# Altium project BY-IOM-v0.2.PrjPCB
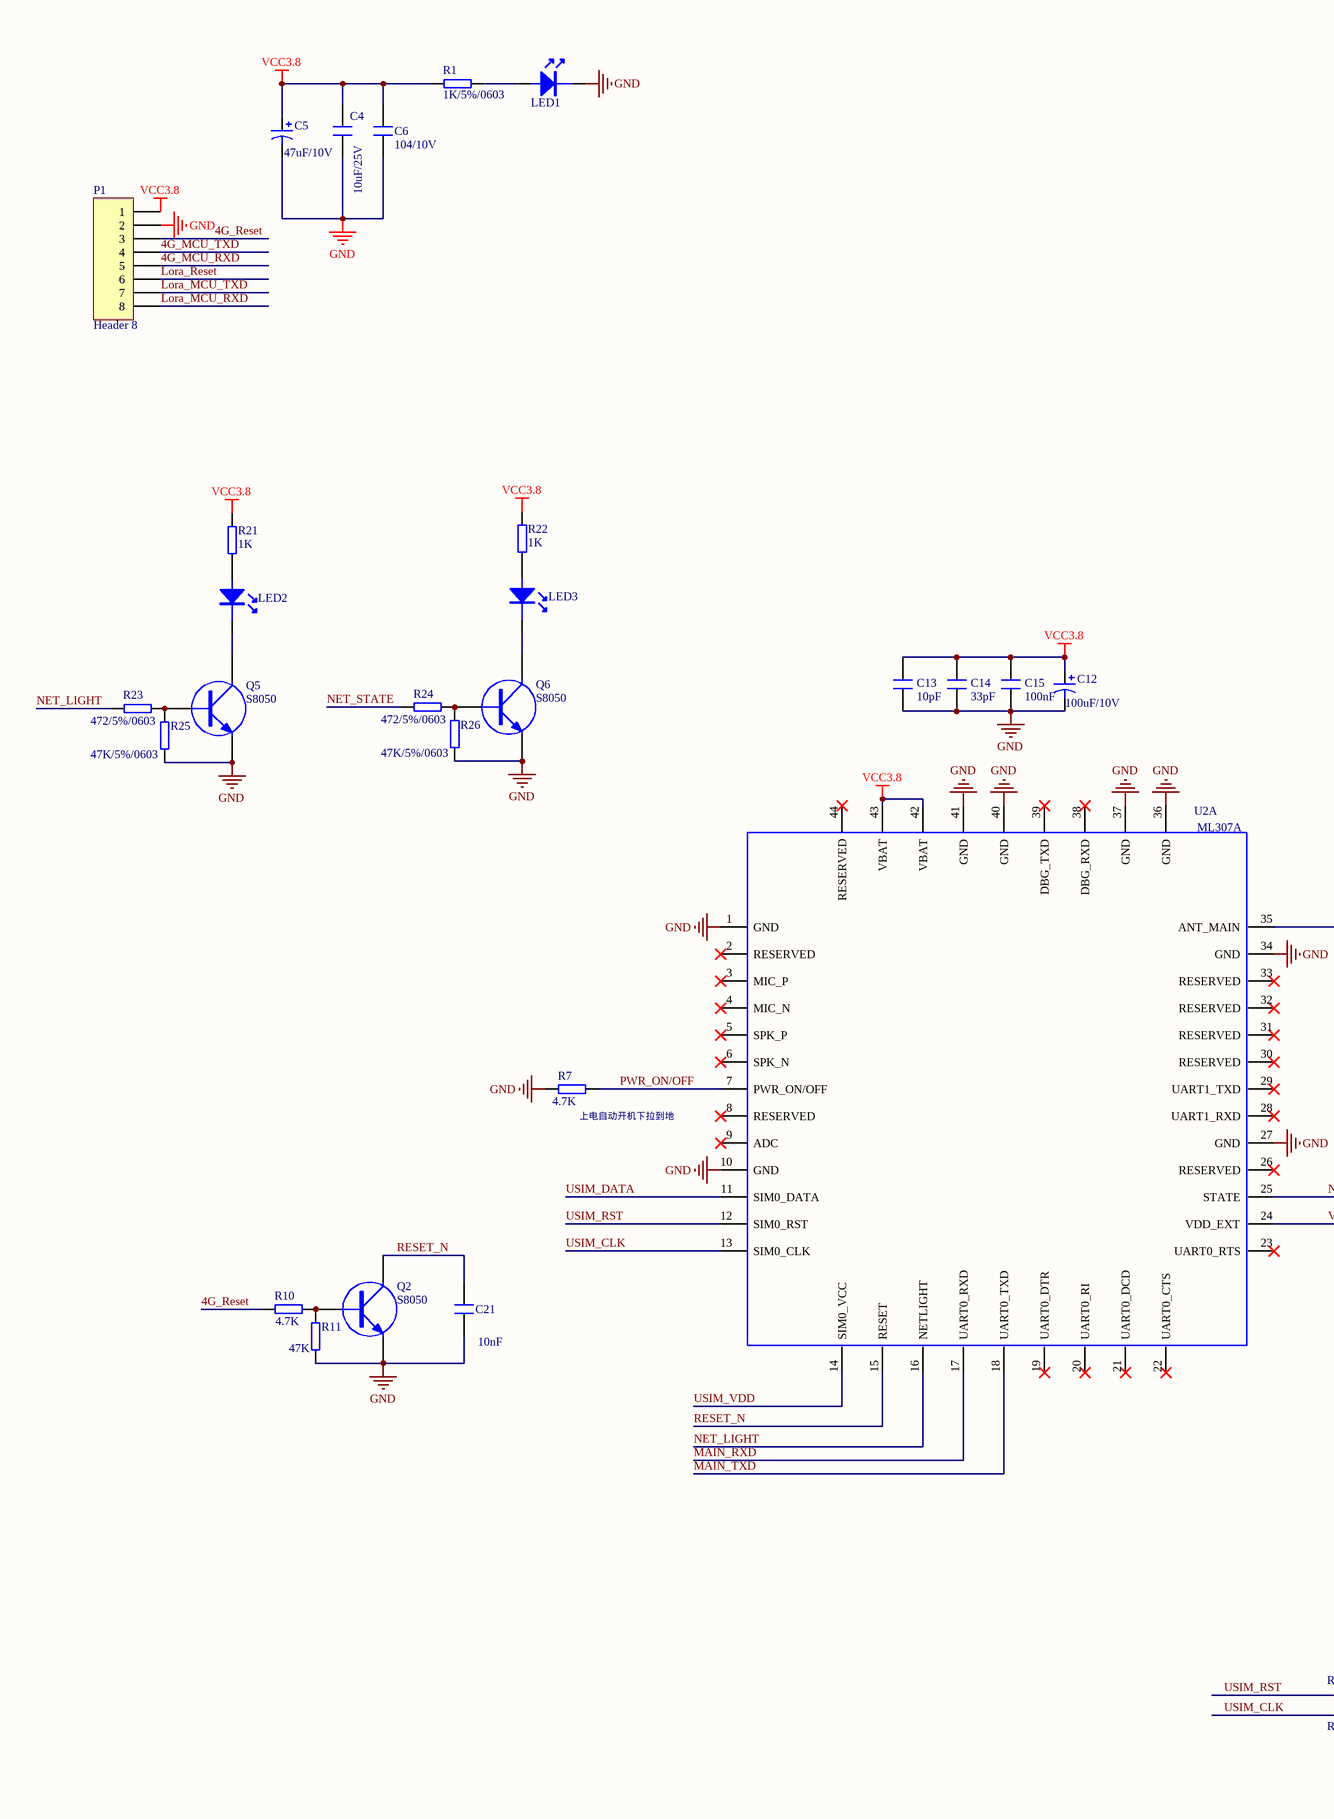
[diagram p0: 4G_Module.SchDoc, left]
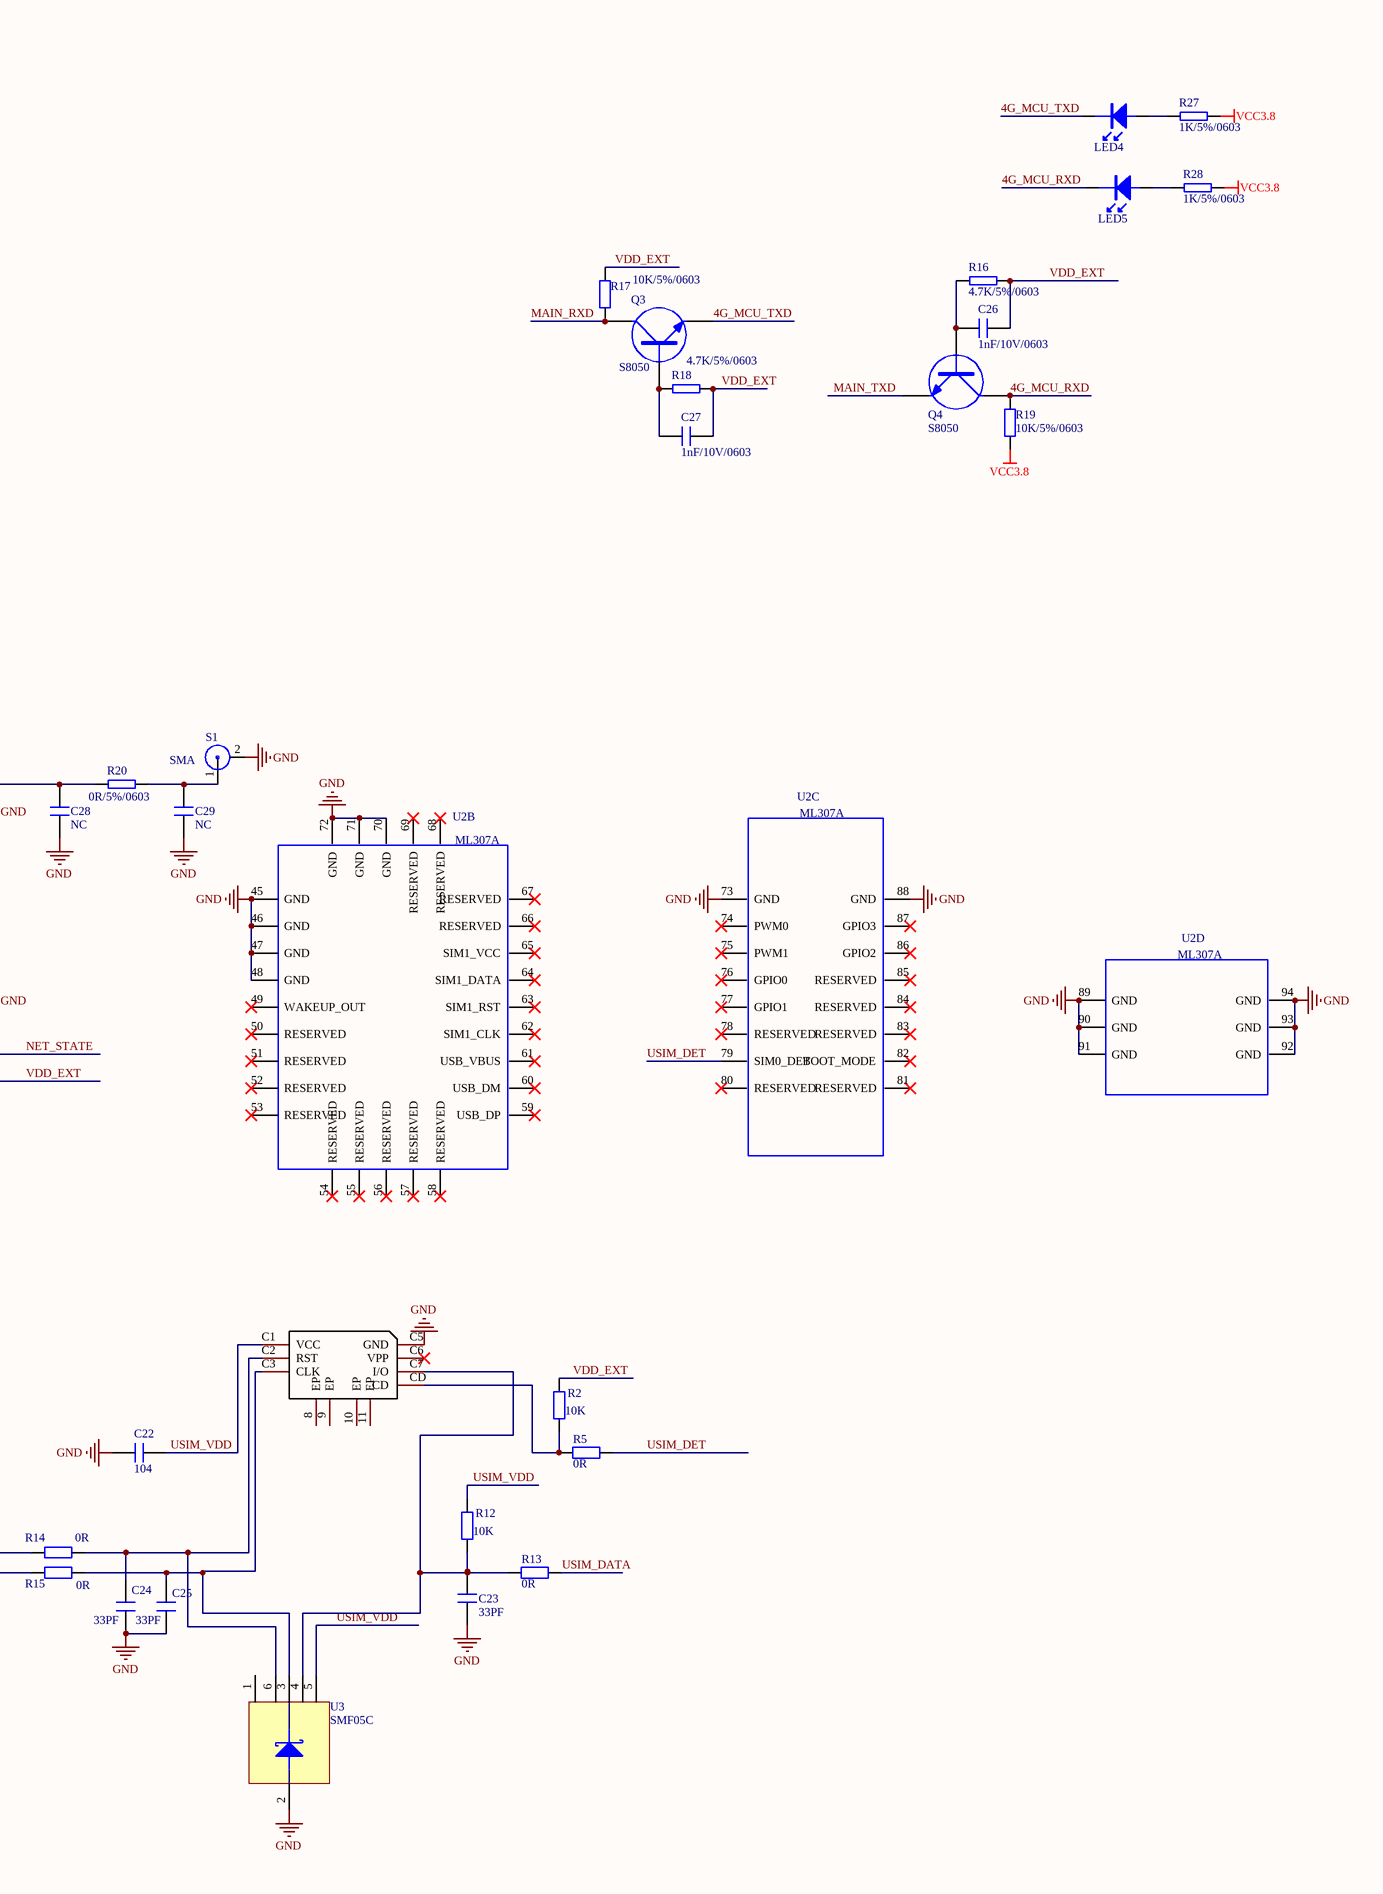
[diagram p1: 4G_Module.SchDoc, right]
1 sheet, 54 parts. Net scope: global (net labels, ports and power ports of the same name join across sheets).
Board file: Power.PcbDoc

## Sheet 4G_Module.SchDoc
size A2

### Parts
C4  10uF/25V  [0603R]
C5  47uF/10V  [0805R]
C6  104/10V  [0603R]
C12  100uF/10V  [C1210]
C13  10pF  [0603R]
C14  33pF  [0603R]
C15  100nF  [0603R]
C21  10nF  [0603R]
C22  104  [0603R]
C23  33PF  [0603R]
C24  33PF  [0603R]
C25  33PF  [0603R]
C26  1nF/10V/0603  [0603R]
C27  1nF/10V/0603  [0603R]
C28  NC  [0603R]
C29  NC  [0603R]
CARD1  SMN-303  [Nano-SIM]  (value not drawn)
LED1  LED  [0603LED]  (value not drawn)
LED2  LED  [0603LED]  (value not drawn)
LED3  LED  [0603LED]  (value not drawn)
LED4  LED  [0603LED]  (value not drawn)
LED5  LED  [0603LED]  (value not drawn)
P1  Header 8  [HDR1X8]
Q2  S8050  [SOT-23]
Q3  S8050  [SOT-23]
Q4  S8050  [SOT-23]
Q5  S8050  [SOT-23]
Q6  S8050  [SOT-23]
R1  1K/5%/0603  [0603R]
R2  10K  [0603R]
R5  0R  [0603R]
R7  4.7K  [0603R]
R10  4.7K  [0603R]
R11  47K  [0603R]
R12  10K  [0603R]
R13  0R  [0603R]
R14  0R  [0603R]
R15  0R  [0603R]
R16  4.7K/5%/0603  [0603R]
R17  10K/5%/0603  [0603R]
R18  4.7K/5%/0603  [0603R]
R19  10K/5%/0603  [0603R]
R20  0R/5%/0603  [0603R]
R21  1K  [0603R]
R22  1K  [0603R]
R23  472/5%/0603  [0603R]
R24  472/5%/0603  [0603R]
R25  47K/5%/0603  [0603R]
R26  47K/5%/0603  [0603R]
R27  1K/5%/0603  [0603R]
R28  1K/5%/0603  [0603R]
S1  SMA  [RF1-00283天线座]
U2  ML307A  [ML307A]  (parts A,B,C,D of 4)
U3  SMF05C  [SC70-6L]

### Nets
GND: C4.1 C5.2 C6.1 C12.2 C13.2 C14.2 C15.2 C21.1 C22.1 C23.1 C24.2 C25.2 C28.1 C29.1 CARD1.C5(GND) LED1.2 P1.2 Q2.2(E) Q5.2(E) Q6.2(E) R7.2 R11.2 R25.2 R26.2 S1.2 U2.1(GND) U2.10(GND) U2.27(GND) U2.34(GND) U2.36(GND) U2.37(GND) U2.40(GND) U2.41(GND) U2.45(GND) U2.46(GND) U2.47(GND) U2.48(GND) U2.70(GND) U2.71(GND) U2.72(GND) U2.73(GND) U2.88(GND) U2.89(GND) U2.90(GND) U2.91(GND) U2.92(GND) U2.93(GND) U2.94(GND) U3.2
VCC3.8: C4.2 C5.1 C6.2 C12.1 C13.1 C14.1 C15.1 P1.1 R1.1 R19.2 R21.2 R22.2 R27.1 R28.1 U2.42(VBAT) U2.43(VBAT)
4G_MCU_RXD: LED5.2 P1.5 Q4.3(C) R19.1
4G_MCU_TXD: LED4.2 P1.4 Q3.2(E)
4G_Reset: P1.3 R10.1
Lora_MCU_RXD: P1.8
Lora_MCU_TXD: P1.7
Lora_Reset: P1.6
MAIN_RXD: Q3.3(C) R17.2 U2.17(UART0_RXD)
MAIN_TXD: Q4.2(E) U2.18(UART0_TXD)
NET_LIGHT: R23.1 U2.16(NETLIGHT)
NET_STATE: R24.1 U2.25(STATE)
PWR_ON/OFF: R7.1 U2.7(PWR_ON/OFF)
RESET_N: C21.2 Q2.3(C) U2.15(RESET)
USIM_CLK: R15.2 U2.13(SIM0_CLK)
USIM_DATA: R13.1 U2.11(SIM0_DATA)
USIM_DET: R5.1 U2.79(SIM0_DET)
USIM_RST: R14.2 U2.12(SIM0_RST)
USIM_VDD: C22.2 CARD1.C1(VCC) R12.1 U2.14(SIM0_VCC) U3.5
VDD_EXT: C26.2 C27.2 R2.1 R16.2 R17.1 R18.2 U2.24(VDD_EXT)
NetC23_2: C23.2 CARD1.C7(I/O) R12.2 R13.2 U3.4
NetC24_1: C24.1 CARD1.C2(RST) R14.1 U3.6
NetC25_1: C25.1 CARD1.C3(CLK) R15.1 U3.3
NetC26_1: C26.1 Q4.1(B) R16.1
NetC27_1: C27.1 Q3.1(B) R18.1
NetC28_2: C28.2 R20.1 U2.35(ANT_MAIN)
NetC29_2: C29.2 R20.2 S1.1
NetCARD1_CD: CARD1.CD R2.2 R5.2
NetLED1_1: LED1.1 R1.2
NetLED2_1: LED2.1 R21.1
NetLED2_2: LED2.2 Q5.3(C)
NetLED3_1: LED3.1 R22.1
NetLED3_2: LED3.2 Q6.3(C)
NetLED4_1: LED4.1 R27.2
NetLED5_1: LED5.1 R28.2
NetQ2_1: Q2.1(B) R10.2 R11.1
NetQ5_1: Q5.1(B) R23.2 R25.1
NetQ6_1: Q6.1(B) R24.2 R26.1

Not connected (* = marked no-connect by the designer): CARD1 8(EP) 9(EP) 10(EP) 11(EP) C6(VPP)*; U2 2(RESERVED)* 3(MIC_P)* 4(MIC_N)* 5(SPK_P)* 6(SPK_N)* 8(RESERVED)* 9(ADC)* 19(UART0_DTR)* 20(UART0_RI)* 21(UART0_DCD)* 22(UART0_CTS)* 23(UART0_RTS)* 26(RESERVED)* 28(UART1_RXD)* 29(UART1_TXD)* 30(RESERVED)* 31(RESERVED)* 32(RESERVED)* 33(RESERVED)* 38(DBG_RXD)* 39(DBG_TXD)* 44(RESERVED)* 49(WAKEUP_OUT)* 50(RESERVED)* 51(RESERVED)* 52(RESERVED)* 53(RESERVED)* 54(RESERVED)* 55(RESERVED)* 56(RESERVED)* 57(RESERVED)* 58(RESERVED)* 59(USB_DP)* 60(USB_DM)* 61(USB_VBUS)* 62(SIM1_CLK)* 63(SIM1_RST)* 64(SIM1_DATA)* 65(SIM1_VCC)* 66(RESERVED)* 67(RESERVED)* 68(RESERVED)* 69(RESERVED)* 74(PWM0)* 75(PWM1)* 76(GPIO0)* 77(GPIO1)* 78(RESERVED)* 80(RESERVED)* 81(RESERVED)* 82(BOOT_MODE)* 83(RESERVED)* 84(RESERVED)* 85(RESERVED)* 86(GPIO2)* 87(GPIO3)*; U3 1

### Notes on the sheet
- (near R7) 上电自动开机下拉到地

### Library data of the parts
C4 C22-C29 = CAP
C5 C12 = Cap Pol1: Polarized Capacitor (Radial); Published: 8-Jun-2000; LatestRevisionDate: 17-Jul-2002; LatestRevisionNote: Re-released for DXP Platform.; PackageReference: RB7.6-15; Publisher: Altium Limited; PackageDescription: Polarized Capacitor (Radial); 2 Leads
C6 C13-C15 C21 = CAP_1
CARD1 = SMN-303: Manufacturer: XUNPU(讯普); Add into BOM: yes; Card Connection Mode: 自弹式; Card Type: NanoSIM卡; Connector Type: 卡座; Body Height (Max): 1.4mm; Name: SMN-303; Symbol: SMN-303; Device: SMN-303; LCSC Part Name: 自弹式 NanoSIM卡 卡座 6+1Pin 带CD 防呆; Supplier Part: C266888; Manufacturer Part: SMN-303; Supplier Footprint: SMD; JLCPCB Part Class: Extended Part; Datasheet: https://atta.szlcsc.com/upload/public/pdf/source/20211019/D7CABD700EC9AD7534EBB952F0541976.pdf; Supplier: LCSC; Convert to PCB: yes; Contact Material: -; Contact Plating: -; Operating Temperature Range: -
P1 = Header 8: Header, 8-Pin; LatestRevisionDate: 17-Jul-2002; LatestRevisionNote: Re-released for DXP Platform.; Publisher: Altium Limited
Q2-Q6 = NPN
R1 R7 R10 R11 R16 R18 R20-R28 = RES
R2 R5 R12-R15 R17 R19 = Res2: Resistor; Published: 8-Jun-2000; LatestRevisionDate: 17-Jul-2002; LatestRevisionNote: Re-released for DXP Platform.; PackageReference: AXIAL-0.4; Publisher: Altium Limited; PackageDescription: Axial Device, Thru-Hole; 2 Leads; 0.4 in Pin Spacing
U2 = ML307A: PCB DECAL: MOD_ML307